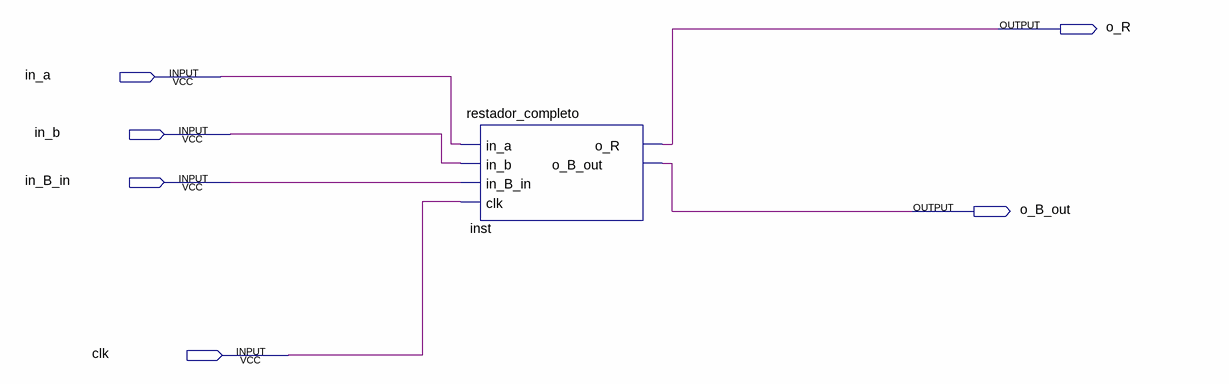
[diagram p0: schematic sheet]
// Quartus schematic restador_completo.bdf as structural Verilog: 1 symbols, 6 pins
module restador_completo (
  input  in_a,
  input  in_b,
  input  in_B_in,
  input  clk,
  output o_R,
  output o_B_out
);

  restador_completo inst (.in_a(in_a), .in_b(in_b), .in_B_in(in_B_in), .clk(clk), .o_R(o_R), .o_B_out(o_B_out));
endmodule
